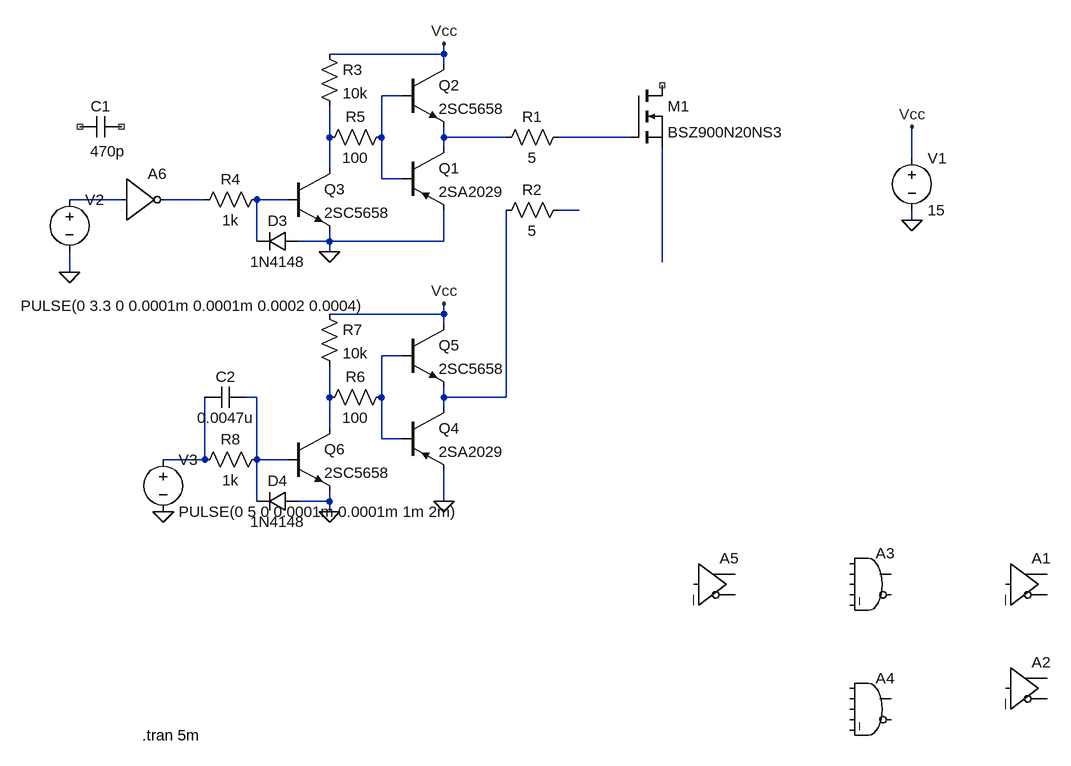
[diagram p0: schematic ACAC直接変換.asc]
ACAC直接変換.asc, the LTspice schematic file:
Version 4
SHEET 1 880 680
WIRE -768 -672 -768 -688
WIRE -768 -672 -944 -672
WIRE -768 -656 -768 -672
WIRE -832 -608 -864 -608
WIRE -944 -544 -944 -592
WIRE -864 -544 -864 -608
WIRE -768 -544 -768 -560
WIRE -672 -544 -768 -544
WIRE -480 -544 -592 -544
WIRE -768 -528 -768 -544
WIRE -48 -512 -48 -560
WIRE -944 -496 -944 -544
WIRE -864 -480 -864 -544
WIRE -832 -480 -864 -480
WIRE -1264 -448 -1344 -448
WIRE -1136 -448 -1200 -448
WIRE -1008 -448 -1056 -448
WIRE -560 -432 -592 -432
WIRE -48 -416 -48 -432
WIRE -1056 -384 -1056 -448
WIRE -944 -384 -944 -400
WIRE -944 -384 -992 -384
WIRE -768 -384 -768 -432
WIRE -768 -384 -944 -384
WIRE -944 -368 -944 -384
WIRE -432 -352 -432 -528
WIRE -1344 -336 -1344 -368
WIRE -768 -272 -768 -288
WIRE -768 -272 -944 -272
WIRE -768 -256 -768 -272
WIRE -832 -208 -864 -208
WIRE -1056 -144 -1072 -144
WIRE -944 -144 -944 -192
WIRE -864 -144 -864 -208
WIRE -768 -144 -768 -160
WIRE -672 -144 -672 -432
WIRE -672 -144 -768 -144
WIRE -768 -128 -768 -144
WIRE -944 -96 -944 -144
WIRE -864 -80 -864 -144
WIRE -832 -80 -864 -80
WIRE -1136 -48 -1136 -144
WIRE -1136 -48 -1200 -48
WIRE -1056 -48 -1056 -144
WIRE -1008 -48 -1056 -48
WIRE -1056 16 -1056 -48
WIRE -944 16 -944 0
WIRE -944 16 -992 16
WIRE -768 16 -768 -32
WIRE -944 32 -944 16
FLAG -48 -416 0
FLAG -48 -560 Vcc
FLAG -768 -688 Vcc
FLAG -944 -368 0
FLAG -1344 -336 0
FLAG -768 16 0
FLAG -768 -288 Vcc
FLAG -944 32 0
FLAG -1200 32 0
SYMBOL res -576 -560 R90
WINDOW 0 0 56 VBottom 2
WINDOW 3 32 56 VTop 2
SYMATTR InstName R1
SYMATTR Value 5
SYMBOL res -576 -448 R90
WINDOW 0 0 56 VBottom 2
WINDOW 3 32 56 VTop 2
SYMATTR InstName R2
SYMATTR Value 5
SYMBOL Digital\\and -112 80 R0
SYMATTR InstName A3
SYMBOL Digital\\and -112 272 R0
SYMATTR InstName A4
SYMBOL Digital\\buf 96 80 R0
SYMATTR InstName A1
SYMBOL Digital\\buf 96 240 R0
SYMATTR InstName A2
SYMBOL Digital\\buf -384 80 R0
SYMATTR InstName A5
SYMBOL voltage -48 -528 R0
WINDOW 123 0 0 Left 0
WINDOW 39 0 0 Left 0
SYMATTR InstName V1
SYMATTR Value 15
SYMBOL pnp -832 -528 R0
SYMATTR InstName Q1
SYMATTR Value 2SA2029
SYMBOL npn -832 -656 R0
SYMATTR InstName Q2
SYMATTR Value 2SC5658
SYMBOL res -848 -560 R90
WINDOW 0 0 56 VBottom 2
WINDOW 3 32 56 VTop 2
SYMATTR InstName R5
SYMATTR Value 100
SYMBOL res -960 -688 R0
SYMATTR InstName R3
SYMATTR Value 10k
SYMBOL res -1040 -464 R90
WINDOW 0 0 56 VBottom 2
WINDOW 3 32 56 VTop 2
SYMATTR InstName R4
SYMATTR Value 1k
SYMBOL npn -1008 -496 R0
SYMATTR InstName Q3
SYMATTR Value 2SC5658
SYMBOL diode -992 -400 R90
WINDOW 0 0 32 VBottom 2
WINDOW 3 32 32 VTop 2
SYMATTR InstName D3
SYMATTR Value 1N4148
SYMBOL cap -1264 -576 R90
WINDOW 0 0 32 VBottom 2
WINDOW 3 38 21 VTop 2
SYMATTR InstName C1
SYMATTR Value 470p
SYMBOL voltage -1344 -464 R0
WINDOW 123 0 0 Left 0
WINDOW 39 0 0 Left 0
WINDOW 3 -75 179 Left 2
SYMATTR InstName V2
SYMATTR Value PULSE(0 3.3 0 0.0001m 0.0001m 0.0002 0.0004)
SYMBOL pnp -832 -128 R0
SYMATTR InstName Q4
SYMATTR Value 2SA2029
SYMBOL npn -832 -256 R0
SYMATTR InstName Q5
SYMATTR Value 2SC5658
SYMBOL res -848 -160 R90
WINDOW 0 0 56 VBottom 2
WINDOW 3 32 56 VTop 2
SYMATTR InstName R6
SYMATTR Value 100
SYMBOL res -960 -288 R0
SYMATTR InstName R7
SYMATTR Value 10k
SYMBOL res -1040 -64 R90
WINDOW 0 0 56 VBottom 2
WINDOW 3 32 56 VTop 2
SYMATTR InstName R8
SYMATTR Value 1k
SYMBOL npn -1008 -96 R0
SYMATTR InstName Q6
SYMATTR Value 2SC5658
SYMBOL diode -992 0 R90
WINDOW 0 0 32 VBottom 2
WINDOW 3 32 32 VTop 2
SYMATTR InstName D4
SYMATTR Value 1N4148
SYMBOL cap -1072 -160 R90
WINDOW 0 0 32 VBottom 2
WINDOW 3 32 32 VTop 2
SYMATTR InstName C2
SYMATTR Value 0.0047u
SYMBOL voltage -1200 -64 R0
WINDOW 123 0 0 Left 0
WINDOW 39 0 0 Left 0
SYMATTR InstName V3
SYMATTR Value PULSE(0 5 0 0.0001m 0.0001m 1m 2m)
SYMBOL Digital\\inv -1264 -512 R0
SYMATTR InstName A6
SYMBOL nmos -480 -624 R0
SYMATTR InstName M1
SYMATTR Value BSZ900N20NS3
TEXT -1232 376 Left 2 !.tran 5m

The netlist it stands for:
* ACAC直接変換.asc
R1 N004 N003 5
R2 N008 N013 5
A3 0 0 0 0 0 0 0 0 AND
A4 0 0 0 0 0 0 0 0 AND
A1 0 0 0 0 0 0 0 0 BUF
A2 0 0 0 0 0 0 0 0 BUF
A5 0 0 0 0 0 0 0 0 BUF
V1 Vcc 0 15
Q1 N003 N001 0 0 2SA2029
Q2 Vcc N001 N003 0 2SC5658
R5 N001 N002 100
R3 Vcc N002 10k
R4 N007 N006 1k
Q3 N002 N007 0 0 2SC5658
D3 0 N007 1N4148
C1 NC_01 NC_02 470p
V2 N005 0 PULSE(0 3.3 0 0.0001m 0.0001m 0.0002 0.0004)
Q4 N013 N010 0 0 2SA2029
Q5 Vcc N010 N013 0 2SC5658
R6 N010 N012 100
R7 Vcc N012 10k
R8 N011 N014 1k
Q6 N012 N011 0 0 2SC5658
D4 0 N011 1N4148
C2 N011 N014 0.0047u
V3 N014 0 PULSE(0 5 0 0.0001m 0.0001m 1m 2m)
A6 N005 0 0 0 0 N006 0 0 BUF
M1 NC_03 N004 N009 N009 BSZ900N20NS3
.model D D
.lib standard.dio
.model NPN NPN
.model PNP PNP
.lib standard.bjt
.model NMOS NMOS
.model PMOS PMOS
.lib standard.mos
.tran 5m
.backanno
.end